# Altium schematic sheet KORUZA_RPi_shield_power.SchDoc
size A4
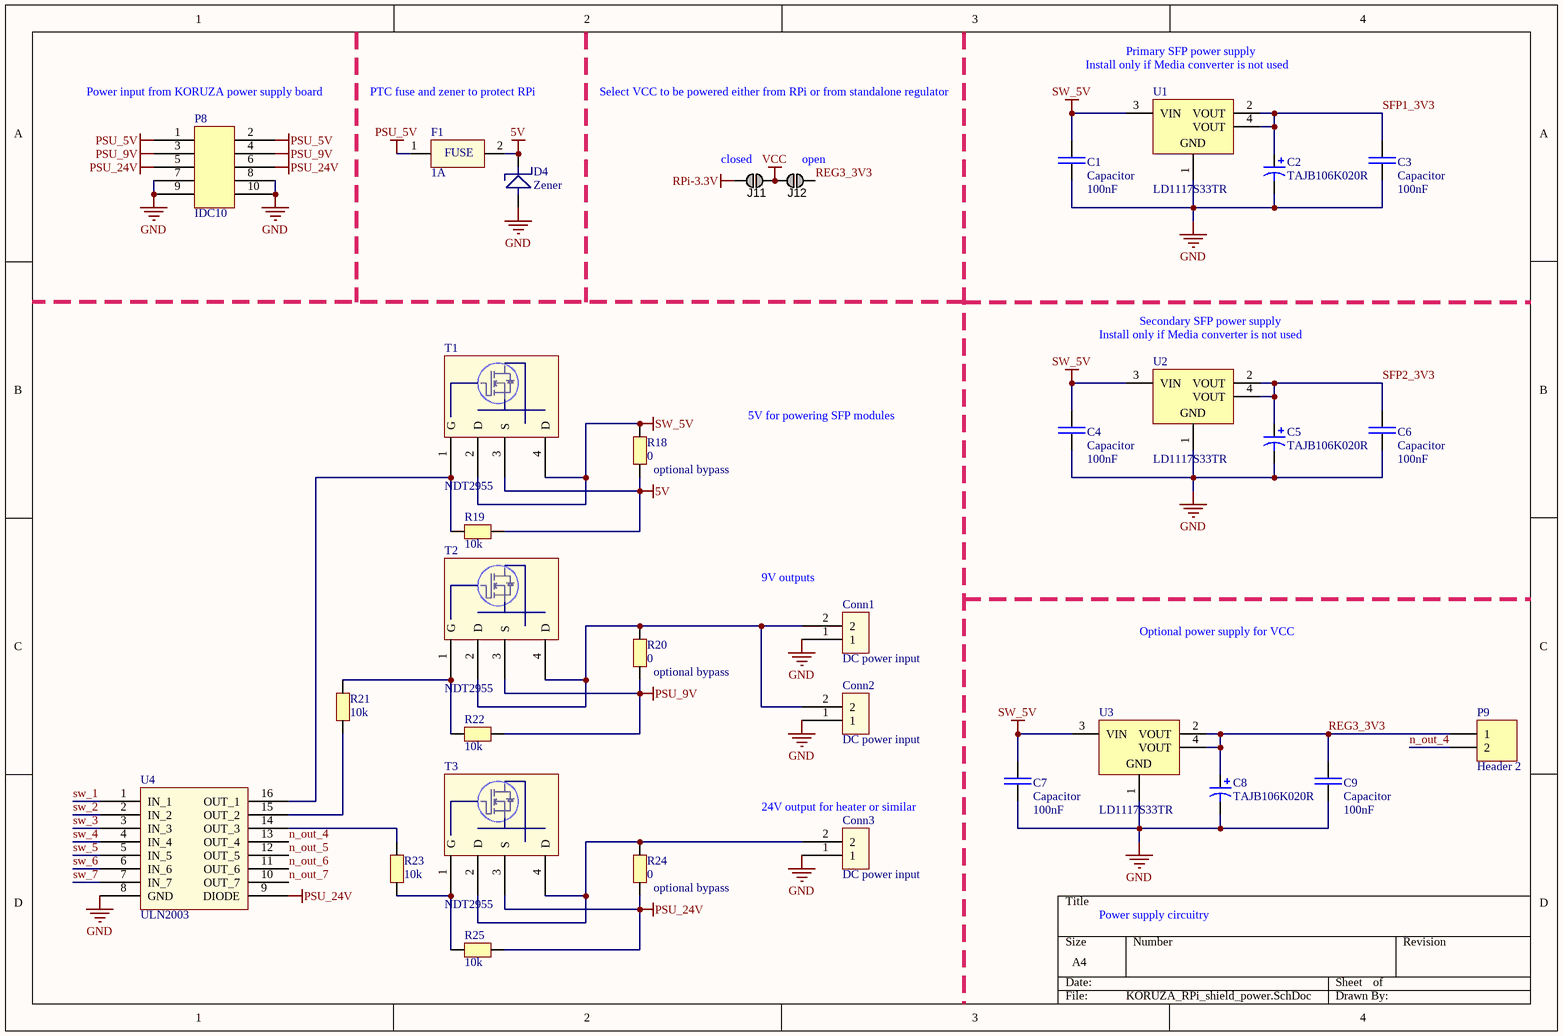
[diagram p0: KORUZA_RPi_shield_power.SchDoc]

## Parts
C1  Capacitor  value 100nF  [0603]
C2  TAJB106K020R  [AVX-CAPC3528_V]
C3  Capacitor  value 100nF  [0603]
C4  Capacitor  value 100nF  [0603]
C5  TAJB106K020R  [AVX-CAPC3528_V]
C6  Capacitor  value 100nF  [0603]
C7  Capacitor  value 100nF  [0603]
C8  TAJB106K020R  [AVX-CAPC3528_V]
C9  Capacitor  value 100nF  [0603]
Conn1  DC power input  [MKDSN 2,5/ 2-5,08 and powercon]
Conn2  DC power input  [MKDSN 2,5/ 2-5,08 and powercon]
Conn3  DC power input  [MKDSN 2,5/ 2-5,08 and powercon]
D4  Zener  [DIOMELF3517N]
F1  1A  [1210]
J11  Jumper  [JUMP1]  (value not drawn)  (no BOM)
J12  Jumper  [JUMP1]  (value not drawn)  (no BOM)
P8  IDC10  [IDC10]
P9  Header 2  [HDR1X2]
R18  0  [RESC2012X06N]
R19  10k  [RESC2012X06N]
R20  0  [RESC2012X06N]
R21  10k  [RESC2012X06N]
R22  10k  [RESC2012X06N]
R23  10k  [RESC2012X06N]
R24  0  [RESC2012X06N]
R25  10k  [RESC2012X06N]
T1  NDT2955  [SOT230P700X180-4N]
T2  NDT2955  [SOT230P700X180-4N]
T3  NDT2955  [SOT230P700X180-4N]
U1  LD1117S33TR  [SOT-223_L]
U2  LD1117S33TR  [SOT-223_L]
U3  LD1117S33TR  [SOT-223_L]
U4  ULN2003  [SO-16 narrow]

## Nets
5V: D4.1 F1.2 R18.2 R19.2 T1.3(S)
GND: C1.2 C2.2 C3.2 C4.2 C5.2 C6.2 C7.2 C8.2 C9.2 Conn1.1 Conn2.1 Conn3.1 D4.2 P8.7 P8.8 P8.9 P8.10 U1.1(GND) U2.1(GND) U3.1(GND) U4.8(GND)
PSU_5V: F1.1 P8.1(A) P8.2
PSU_9V: P8.3 P8.4 R20.2 R22.2 T2.3(S)
PSU_24V: P8.5 P8.6 R24.2 R25.2 T3.3(S) U4.9(DIODE)
RPi-3.3V: J11.1
SW_5V: C1.1 C4.1 C7.1 R18.1 T1.2(D) T1.4(D) U1.3(VIN) U2.3(VIN) U3.3(VIN)
VCC: J11.2 J12.1
n_out_4: P9.2 U4.13(OUT_4)
n_out_5: U4.12(OUT_5)
n_out_6: U4.11(OUT_6)
n_out_7: U4.10(OUT_7)
REG3_3V3: C8.1 C9.1 J12.2 P9.1 U3.2(VOUT) U3.4(VOUT)
SFP1_3V3: C2.1 C3.1 U1.2(VOUT) U1.4(VOUT)
SFP2_3V3: C5.1 C6.1 U2.2(VOUT) U2.4(VOUT)
sw_1: U4.1(IN_1)
sw_2: U4.2(IN_2)
sw_3: U4.3(IN_3)
sw_4: U4.4(IN_4)
sw_5: U4.5(IN_5)
sw_6: U4.6(IN_6)
sw_7: U4.7(IN_7)
NetConn1_2: Conn1.2 Conn2.2 R20.1 T2.2(D) T2.4(D)
NetConn3_2: Conn3.2 R24.1 T3.2(D) T3.4(D)
NetR19_1: R19.1 T1.1(G) U4.16(OUT_1)
NetR21_1: R21.1 U4.15(OUT_2)
NetR21_2: R21.2 R22.1 T2.1(G)
NetR23_1: R23.1 R25.1 T3.1(G)
NetR23_2: R23.2 U4.14(OUT_3)

## Notes on the sheet
- (near P8) Power input from KORUZA power supply board
- PTC fuse and zener to protect RPi
- Select VCC to be powered either from RPi or from standalone regulator
- (near U1) Install only if Media converter is not used
- Primary SFP power supply
- (near J11) closed
- (near J12) open
- (near U2) Install only if Media converter is not used
- Secondary SFP power supply
- 5V for powering SFP modules
- (near R18) optional bypass
- (near Conn1) 9V outputs
- Optional power supply for VCC
- (near R20) optional bypass
- (near Conn3) 24V output for heater or similar
- (near R24) optional bypass
- Power supply circuitry
- (in symbol Fuse) FUSE

## Library data of the parts
C1 C3 C4 C6 C7 C9 = Capacitor: General capacitor
C2 C5 C8 = CMP-0279-00001-1: Capacitor, Tantalum, 10uF 10% 20V MCCT-B (3528); Manufacturer: AVX; Polarity: Polarized; PartNumber: TAJB106K020R; PackageDescription: 2-Pin SMT Capacitor, 3.5 x 2.8 mm Body; ComponentLink1URL: http://www.avx.com/; PackageReference: CAPC3528; ComponentLink2Description: Datasheet; Capacitance: 10uF; Technology: Tantalum; ComponentLink2URL: http://www.avx.com/docs/Catalogs/taj.pdf; Tolerance: 10%; ComponentLink1Description: Manufacturer URL; Rated Voltage: 20V; DatasheetVersion: Jun-13; Mounting Technology: Surface Mount
Conn1-Conn3 = PowerScrewTerminal
F1 = Fuse: 1A fuse
J11 J12 = JUMP1: SMD jumper
P8 = IDC10: IDC 10pin
P9 = Header 2: Header, 2-Pin; LatestRevisionDate: 17-Jul-2002; LatestRevisionNote: Re-released for DXP Platform.; Publisher: Altium Limited
R18-R25 = Resistor: Resistor 0805 smd
T1-T3 = NDT2955: P MOSFET
U1-U3 = CMP-0244-00310-1: Fixed Low Drop Positive Voltage Regulator, 3.3V, 4-Pin SOT-223, Tape and Reel; ComponentLink2Description: Datasheet; PackageDescription: 4-Pin SOT-223 Package, 6.5 x 3.5 mm Body, 2.3 mm Pitch, 7 mm Lead Span; PackageVersion: 2010; ComponentLink2URL: http://www.st.com/internet/com/TECHNICAL_RESOURCES/TECHNICAL_LITERATURE/DATASHEET/CD00000544.pdf; PackageReference: SOT-223; DatasheetVersion: 1/11/2011; ComponentLink1Description: Manufacturer URL; ComponentLink1URL: http://www.st.com
U4 = ULN2003: Darlington array